# EAGLE design IN-16 Clock (EAGLE 8.1.0)
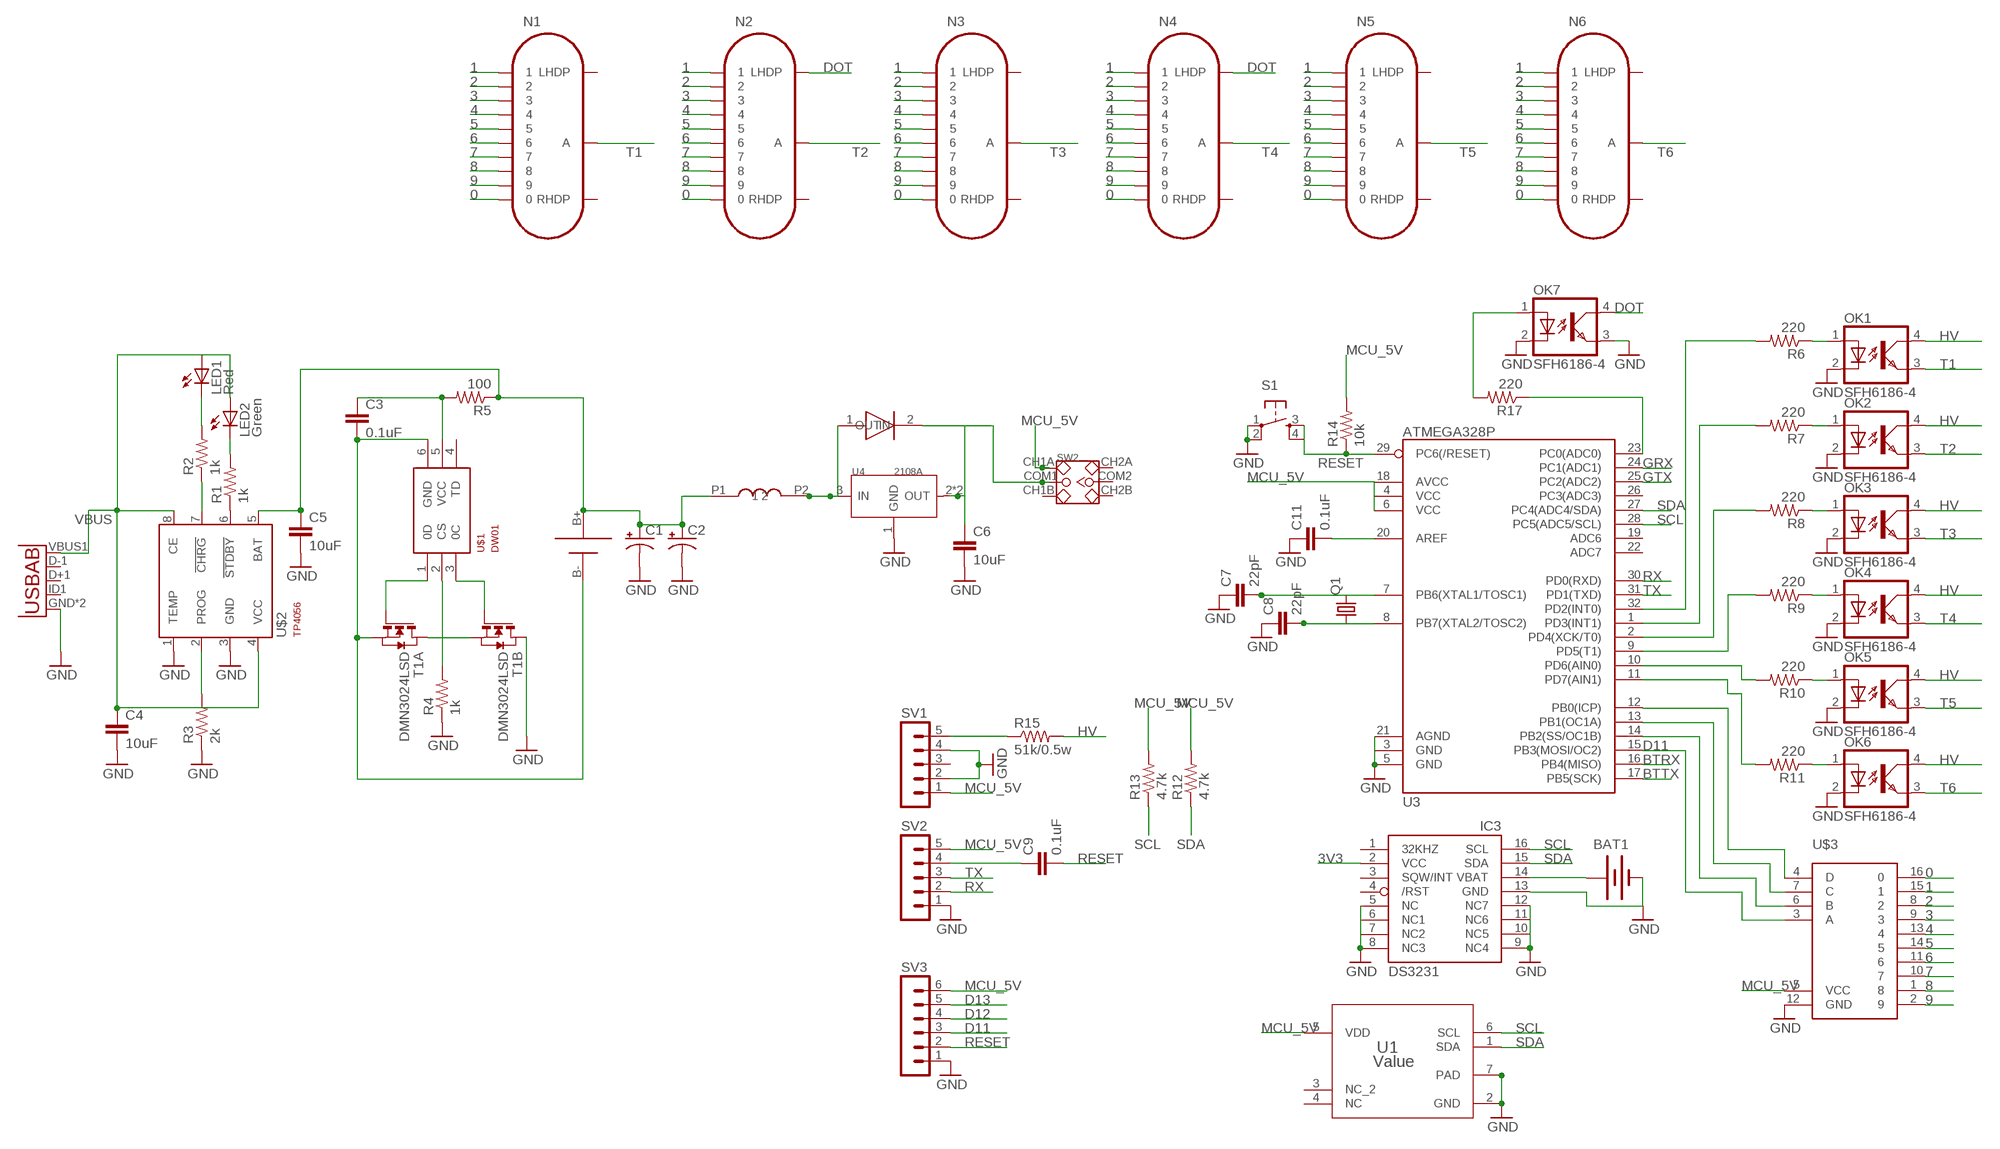
[diagram p0: schematic, sheet 1, part 1 of 2]
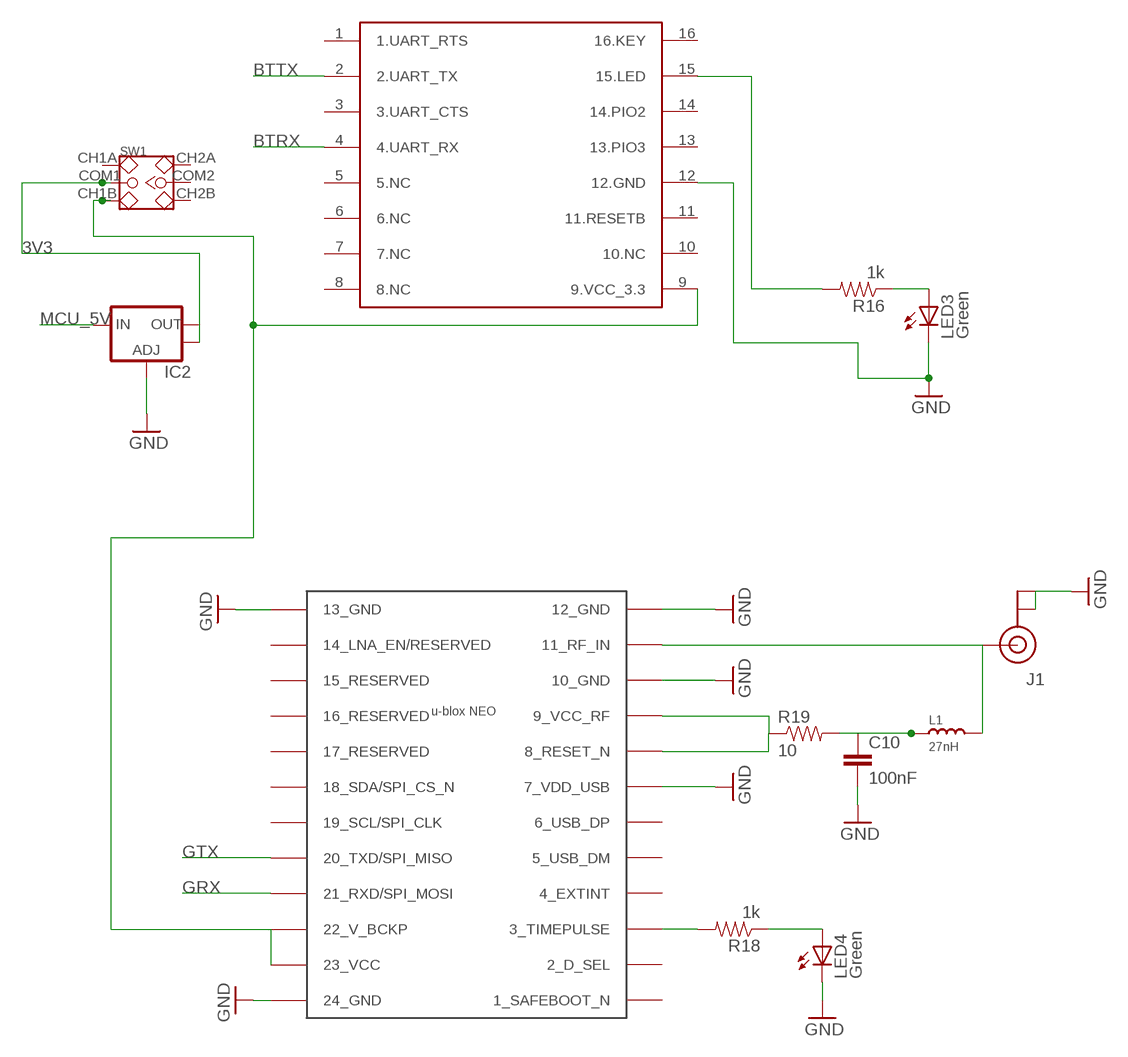
[diagram p1: schematic, sheet 1, part 2 of 2]

## Parts
BAT1  BATTERY20PTH  [BATTCOM_20MM_PTH]
C1  CAP_POLF80  [NIPPON_F80]
C2  CAP_POLF80  [NIPPON_F80]
C3  0.1uF  0.1UF-25V-5%(0603)  [0603-CAP]
C4  10uF  0.1UF-25V-5%(0603)  [0603-CAP]
C5  10uF  0.1UF-25V-5%(0603)  [0603-CAP]
C6  10uF  0.1UF-25V-5%(0603)  [0603-CAP]
C7  22pF  0.1UF-25V-5%(0603)  [0603-CAP]
C8  22pF  0.1UF-25V-5%(0603)  [0603-CAP]
C9  0.1uF  0.1UF-25V-5%(0603)  [0603-CAP]
C10  100nF  .22UF-CER  [0402-CAP]
C11  0.1uF  0.1UF-25V-5%(0603)  [0603-CAP]
IC2  V_REG_LM1117SOT223  [SOT223]
IC3  DS3231/SO  [SO16W]
J1  U.FL  [U.FL]
L1  27nH  SMD-FERRITE-BEAD-2500R-50MA(0603)  [L0603]
LED1  Red  LEDCHIP-LED0805  [CHIP-LED0805]
LED2  Green  LEDCHIP-LED0805  [CHIP-LED0805]
LED3  Green  LEDCHIP-LED0805  [CHIP-LED0805]
LED4  Green  LEDCHIP-LED0805  [CHIP-LED0805]
N1  IN-16  [IN-16]
N2  IN-16  [IN-16]
N3  IN-16  [IN-16]
N4  IN-16  [IN-16]
N5  IN-16  [IN-16]
N6  IN-16  [IN-16]
OK1  SFH6186-4  [SMD4-7]
OK2  SFH6186-4  [SMD4-7]
OK3  SFH6186-4  [SMD4-7]
OK4  SFH6186-4  [SMD4-7]
OK5  SFH6186-4  [SMD4-7]
OK6  SFH6186-4  [SMD4-7]
OK7  SFH6186-4  [SMD4-7]
Q1  CRYSTALSM49  [SM49]
R1  1k  1.2MOHMS-1/10W-1%(0603)  [0603-RES]
R2  1k  1.2MOHMS-1/10W-1%(0603)  [0603-RES]
R3  2k  1.2MOHMS-1/10W-1%(0603)  [0603-RES]
R4  1k  1.2MOHMS-1/10W-1%(0603)  [0603-RES]
R5  100  1.2MOHMS-1/10W-1%(0603)  [0603-RES]
R6  220  1.2MOHMS-1/10W-1%(0603)  [0603-RES]
R7  220  1.2MOHMS-1/10W-1%(0603)  [0603-RES]
R8  220  1.2MOHMS-1/10W-1%(0603)  [0603-RES]
R9  220  1.2MOHMS-1/10W-1%(0603)  [0603-RES]
R10  220  1.2MOHMS-1/10W-1%(0603)  [0603-RES]
R11  220  1.2MOHMS-1/10W-1%(0603)  [0603-RES]
R12  4.7k  1.2MOHMS-1/10W-1%(0603)  [0603-RES]
R13  4.7k  1.2MOHMS-1/10W-1%(0603)  [0603-RES]
R14  10k  1.2MOHMS-1/10W-1%(0603)  [0603-RES]
R15  51k/0.5w  R-US_0207/12  [0207/12]
R16  1k  1.2MOHMS-1/10W-1%(0603)  [0603-RES]
R17  220  1.2MOHMS-1/10W-1%(0603)  [0603-RES]
R18  1k  1.2MOHMS-1/10W-1%(0603)  [0603-RES]
R19  10  RESISTOR0603  [0603-RES]
S1  TAC_SWITCHSMD  [TACTILE_SWITCH_SMD]
SV1  MA05-1  [MA05-1]
SV2  MA05-1  [MA05-1]
SV3  MA06-1  [MA06-1]
SW1  SMD-TOGGLE-SWITCH-2CH(2X3P-7X3.5MM)  [SW6-2.54-SMD-7.0X3.5X1.5MM]
SW2  SMD-TOGGLE-SWITCH-2CH(2X3P-7X3.5MM)  [SW6-2.54-SMD-7.0X3.5X1.5MM]
T1  DMN3024LSD  [TSSOP-8]
U1  Value  HDC1080DMBR  [DMB0006A]
U2  USB""  [USB-MICRO-SMD]
U3  ATMEGA328P  ATMEGA328_SMT  [TQFP32-08]
U4  2108A  PMIC-CJA1117B-3.3(SOT-89)  [SOT-89]
U$1  DW01  [SOT23-6]
U$2  TP4056  [SOT23-8]
U$3  K155ID1  [DIL16-KIT]
U$5  22uH  CD54  [CD54]
U$6  SMA-SS34  [SMA-SS34]
U$7  18650SMD  [18650SMD]
U$8  NEO-M8  [NEO-M8]
U$9  HM-13  [HM-13]

## Nets
0: N1.0 N2.0 N3.0 N4.0 N5.0 N6.0 U$3.16
1: N1.1 N2.1 N3.1 N4.1 N5.1 N6.1 U$3.15
2: N1.2 N2.2 N3.2 N4.2 N5.2 N6.2 U$3.8
3: N1.3 N2.3 N3.3 N4.3 N5.3 N6.3 U$3.9
3V3: IC2.2(OUT) IC2.4(OUT) IC3.2(VCC) SW1.COM1
4: N1.4 N2.4 N3.4 N4.4 N5.4 N6.4 U$3.13
5: N1.5 N2.5 N3.5 N4.5 N5.5 N6.5 U$3.14
6: N1.6 N2.6 N3.6 N4.6 N5.6 N6.6 U$3.11
7: N1.7 N2.7 N3.7 N4.7 N5.7 N6.7 U$3.10
8: N1.8 N2.8 N3.8 N4.8 N5.8 N6.8 U$3.1
9: N1.9 N2.9 N3.9 N4.9 N5.9 N6.9 U$3.2
BTRX: U3.16(PB4(MISO)) U$9.4(4.UART_RX)
BTTX: U3.17(PB5(SCK)) U$9.2(2.UART_TX)
D11: SV3.3 U3.15(PB3(MOSI/OC2)) U$3.3(A)
D12: SV3.4
D13: SV3.5
DOT: N2.LHDP N4.LHDP OK7.4(COL)
GND: BAT1.2(-) C1.- C2.- C4.2 C5.2 C6.2 C7.1 C8.1 C10.2 C11.1 IC2.1(ADJ) IC3.5(NC) IC3.6(NC1) IC3.7(NC2) IC3.8(NC3) IC3.9(NC4) IC3.10(NC5) IC3.11(NC6) IC3.12(NC7) IC3.13(GND) J1.P$1(GND) J1.P$2(GND) LED3.C LED4.C OK1.2(C) OK2.2(C) OK3.2(C) OK4.2(C) OK5.2(C) OK6.2(C) OK7.2(C) OK7.3(EMIT) R3.1 R4.1 S1.1 S1.2 SV1.2 SV1.4 SV2.1 SV3.1 T1.8(B:D) U1.2(GND) U1.7(PAD) U2.GND U2.GND1(GND) U3.3(GND) U3.5(GND) U3.21(AGND) U4.1(GND) U$2.1(TEMP) U$2.3(GND) U$3.12(GND) U$8.7(7_VDD_USB) U$8.10(10_GND) U$8.12(12_GND) U$8.13(13_GND) U$8.24(24_GND) U$9.12(12.GND)
GRX: U3.24(PC1(ADC1)) U$8.21(21_RXD/SPI_MOSI)
GTX: U3.25(PC2(ADC2)) U$8.20(20_TXD/SPI_MISO)
HV: OK1.4(COL) OK2.4(COL) OK3.4(COL) OK4.4(COL) OK5.4(COL) OK6.4(COL) R15.2
MCU_5V: IC2.3(IN) R12.2 R13.2 R14.2 SV1.1 SV2.5 SV3.6 SW2.CH1A U1.5(VDD) U3.4(VCC) U3.6(VCC) U3.18(AVCC) U$3.5(VCC)
N$1: LED2.C R1.2
N$2: R1.1 U$2.6(!STDBY)
N$3: LED1.C R2.2
N$4: R2.1 U$2.7(!CHRG)
N$5: R3.2 U$2.2(PROG)
N$6: U4.3(IN) U$5.P2 U$6.1(IN)
N$7: C6.1 SW2.COM1 U4.2(OUT) U4.4(OUT) U$6.2(OUT)
N$8: T1.1(A:D) T1.6(B:S) T1.7(B:S)
N$9: T1.4(A:G) U$1.1(0D)
N$10: T1.5(B:G) U$1.3(0C)
N$11: R4.2 U$1.2(CS)
N$12: C3.2 T1.2(A:S) T1.3(A:S) U$1.6(GND) U$7.B-
N$13: C3.1 R5.2 U$1.5(VCC)
N$14: C1.+ C2.+ C5.1 R5.1 U$2.5(BAT) U$5.P1 U$7.B+
N$15: C7.2 Q1.2 U3.7(PB6(XTAL1/TOSC1))
N$16: C8.2 Q1.1 U3.8(PB7(XTAL2/TOSC2))
N$17: BAT1.1(+) IC3.14(VBAT)
N$18: C11.2 U3.20(AREF)
N$19: R15.1 SV1.5
N$20: R18.2 U$8.3(3_TIMEPULSE)
N$21: LED4.A R18.1
N$22: OK1.1(A) R6.1
N$23: OK2.1(A) R7.1
N$24: OK3.1(A) R8.1
N$25: OK4.1(A) R9.1
N$26: OK5.1(A) R10.1
N$27: OK6.1(A) R11.1
N$28: R6.2 U3.32(PD2(INT0))
N$29: R7.2 U3.1(PD3(INT1))
N$30: R8.2 U3.2(PD4(XCK/T0))
N$31: R9.2 U3.9(PD5(T1))
N$32: R10.2 U3.10(PD6(AIN0))
N$33: R11.2 U3.11(PD7(AIN1))
N$34: U3.12(PB0(ICP)) U$3.4(D)
N$35: U3.13(PB1(OC1A)) U$3.7(C)
N$36: U3.14(PB2(SS/OC1B)) U$3.6(B)
N$37: R17.1 U3.23(PC0(ADC0))
N$39: SW1.CH1B U$8.22(22_V_BCKP) U$8.23(23_VCC) U$9.9(9.VCC_3.3)
N$40: OK7.1(A) R17.2
N$41: C9.1 SV2.4
N$42: R16.2 U$9.15(15.LED)
N$43: LED3.A R16.1
N$44: C10.1 L1.1 R19.2
N$45: R19.1 U$8.8(8_RESET_N) U$8.9(9_VCC_RF)
N$47: J1.P$3(SIGNAL) L1.2 U$8.11(11_RF_IN)
RESET: C9.2 R14.1 S1.3 S1.4 SV3.2 U3.29(PC6(/RESET))
RX: SV2.2 U3.30(PD0(RXD))
SCL: IC3.16(SCL) R13.1 U1.6(SCL) U3.28(PC5(ADC5/SCL))
SDA: IC3.15(SDA) R12.1 U1.1(SDA) U3.27(PC4(ADC4/SDA))
T1: N1.A OK1.3(EMIT)
T2: N2.A OK2.3(EMIT)
T3: N3.A OK3.3(EMIT)
T4: N4.A OK4.3(EMIT)
T5: N5.A OK5.3(EMIT)
T6: N6.A OK6.3(EMIT)
TX: SV2.3 U3.31(PD1(TXD))
VBUS: C4.1 LED1.A LED2.A U2.VBUS1(VBUS) U$2.4(VCC) U$2.8(CE)
Unconnected: IC3.1(32KHZ) IC3.3(SQW/INT) IC3.4(/RST) N1.LHDP N1.RHDP N2.RHDP N3.LHDP N3.RHDP N4.RHDP N5.LHDP N5.RHDP N6.LHDP N6.RHDP SV1.3 SW1.CH1A SW1.CH2A SW1.CH2B SW1.COM2 SW2.CH1B SW2.CH2A SW2.CH2B SW2.COM2 U1.3(NC_2) U1.4(NC) U2.D+1(D+) U2.D-1(D-) U2.ID1(USBID) U3.19(ADC6) U3.22(ADC7) U3.26(PC3(ADC3)) U$1.4(TD) U$8.1(1_SAFEBOOT_N) U$8.2(2_D_SEL) U$8.4(4_EXTINT) U$8.5(5_USB_DM) U$8.6(6_USB_DP) U$8.14(14_LNA_EN/RESERVED) U$8.15(15_RESERVED) U$8.16(16_RESERVED) U$8.17(17_RESERVED) U$8.18(18_SDA/SPI_CS_N) U$8.19(19_SCL/SPI_CLK) U$9.1(1.UART_RTS) U$9.3(3.UART_CTS) U$9.5(5.NC) U$9.6(6.NC) U$9.7(7.NC) U$9.8(8.NC) U$9.10(10.NC) U$9.11(11.RESETB) U$9.13(13.PIO3) U$9.14(14.PIO2) U$9.16(16.KEY)

## Library data of the parts
BAT1 = SparkFun-Electromechanical:BATTERY: Battery Holders Various common sizes : AA, AAA, 20mm coin cell and 12mm coin cell. 20MM_4LEGS, BATT-10373
C1 C2 = SparkFun-Capacitors:CAP_POL: Capacitor Polarized These are standard SMD and PTH capacitors. Normally 10uF, 47uF, and 100uF in electrolytic and tantalum varieties. Always verify the external diameter of the through hole cap, it varies with capacity, voltage, and manufacturer. The EIA devices should be standard.
C3 C9 C11 = SparkFun-Capacitors:0.1UF-25V-5%(0603): CAP-08604; PROD_ID: CAP-08604
C4-C8 = SparkFun-Capacitors:0.1UF-25V-5%(0603): CAP-08604; PROD_ID: CAP-08604; VALUE: 0.1uF
C10 = SparkFun-Capacitors:.22UF-CER: .22uF ceramic SMT CAP-09885- 50V +80%/-20% (0603); PROD_ID: CAP-09885; VALUE: .22uF
IC2 = SparkFun-PowerIC:V_REG_LM1117: Voltage Regulator LM1117 Standard adjustable voltage regulator but in SMD form. Spark Fun Electronics SKU : COM-00595
IC3 = adafruit:DS3231
J1 = SparkFun-Connectors:U.FL: SMD antenna connector- WRL-09144; PROD_ID: CONN-09193
L1 = Seeed-OPL-Inductor:SMD-FERRITE-BEAD-2500R-50MA(0603): 303030020; VALUE: 2500R-50MA
LED1-LED4 = adafruit:LED: LED OSRAM: - CHIPLED LG R971, LG N971, LY N971, LG Q971, LY Q971, LO R971, LY R971 LH N974, LH R974 LS Q976, LO Q976, LY Q976 LO Q996 - Hyper CHIPLED LW Q18S LB Q993, LB Q99A, LB R99A - SideLED LS A670, LO A670, LY A670, LG A670, LP A670 LB A673, LV A673, LT A673, LW A673 LH A674 LY A675 LS A676, LA A676, LO A676, LY A676, LW A676 LS A679, LY A679, LG A679 - Hyper Micro SIDELED® LS Y876, LA Y876, LO Y876, LY Y876 LT Y87S - SmartLED LW L88C, LW L88S LB L89C, LB L89S, LG L890 LS L89K, LO L89K, LY L89K LS L896, LA L896, LO L896, LY L896 - TOPLED LS T670, LO T670, LY T670, LG T670, LP T670 LSG T670, LSP T670, LSY T670, LOP T670, LYG T670 LG T671, LOG T671, LSG T671 LB T673, LV T673, LT T673, LW T673 LH T674 LS T676, LA T676, LO T676, LY T676, LB T676, LH T676, LSB T676, LW T676 LB T67C, LV T67C, LT T67C, LS T67K, LO T67K, LY T67K, LW E67C LS E67B, LA E67B, LO E67B, LY E67B, LB E67C, LV E67C, LT E67C LW T67C LS T679, LY T679, LG T679 LS T770, LO T770, LY T770, LG T770, LP T770 LB T773, LV T773, LT T773, LW T773 LH T774 LS E675, LA E675, LY E675, LS T675 LS T776, LA T776, LO T776, LY T776, LB T776 LHGB T686 LT T68C, LB T68C - Hyper Mini TOPLED® LB M676 - Mini TOPLED Santana® LG M470 LS M47K, LO M47K, LY M47K Source: http://www.osram.convergy.de/
N1-N6 = russian-nixies:IN-16: IN-16: small numeric frontview nixie tube
OK1-OK7 = optocoupler:SFH618?*: Optocoupler, Phototransistor Output, Low Input Current Source: Data sheet <http://www.vishay.com/docs/83673/sfh618.pdf>; MF: VISHAY/TELEFUNKEN; MPN: SFH6186-4; OC_FARNELL: 1469530; OC_NEWARK: 21H7753
Q1 = adafruit:CRYSTAL: CRYSTAL; OC_FARNELL: unknown; OC_NEWARK: unknown
R1-R14 R16-R18 = SparkFun-Resistors:1.2MOHMS-1/10W-1%(0603): RES-10055; PROD_ID: RES-10055; VALUE: 1.2M
R15 = resistor:R-US_: RESISTOR, American symbol
R19 = SparkFun-Resistors:RESISTOR: Resistor Basic schematic elements and footprints for 0603, 1206, and PTH resistors.
S1 = SparkFun-Electromechanical:TAC_SWITCH: Momentary Switch Button commonly used for reset or general input. Spark Fun Electronics SKU : COM-00097 SMT- SWCH-08247; PROD_ID: SWCH-08247
SV1 SV2 = con-lstb:MA05-1: PIN HEADER; OC_FARNELL: unknown; OC_NEWARK: unknown
SV3 = con-lstb:MA06-1: PIN HEADER; OC_FARNELL: unknown; OC_NEWARK: unknown
SW1 SW2 = Seeed-OPL-Switch:SMD-TOGGLE-SWITCH-2CH(2X3P-7X3.5MM): 311030005
T1 = FS8205A:DMN3024LSD: DUAL N-CHANNEL ENHANCEMENT MODE MOSFET data sheet <http://goo.gl/dRgboR> Dave.Calaway Eagle Library <https://goo.gl/Muy1Tr>
U1 = HDC1080:HDC1080DMBR; ALTERNATEPARTNUMBER: HDC1080DMBT; APPLICATION_BUILDNUMBER: *; COMPTYPE: IC; MANUFACTURER: Texas Instruments; MOUNTTYPE: SMT; PACKAGEREFERENCE: DMB0006A; PARTNUMBER: HDC1080DMBR; PIN_COUNT: 7; REFDES: RefDes; TYPE: TYPE
U2 = MicroUSB Long:USB: This is a USB AB connector that is compatible with USB OTG. i.e. this connector can serve as a host or device
U3 = SparkFun-DigitalIC:ATMEGA328_SMT: 32-Pin Atmega328 part Commonly used on Arduino compatible boards Available in QFP and QFN packages TQFP is IC-09069 QFN is non-stock; PROD_ID: IC-09069
U4 = Seeed-OPL-ic:PMIC-CJA1117B-3.3(SOT-89): 310030095; MPN: CJA1117B-3.3; VALUE: CJA1117B-3.3-SOT89
U$1 = DW01:DW01: The DW01-P battery protection IC is designed to protect lithium-ion/polymer battery from damage or degrading the lifetime due to overcharge, overdischarge, and/or overcurrent for one-cell lithium-ion/polymer battery powered systems, such as cellular phones. Data sheet <http://goo.gl/4y108d> Dave.Calaway Eagle Library <https://goo.gl/Muy1Tr>
U$2 = TP4056:TP4056: TP4056 Data sheet <http://goo.gl/J7k8TF> Dave.Calaway Eagle Library <https://goo.gl/Muy1Tr>
U$3 = Nixie:K155ID1
U$5 = CD54:CD54
U$6 = SMA-SS34:SMA-SS34
U$7 = 18650SMD:18650SMD
U$8 = ubloxLib:NEO-M8: u-blox NEO GNSS module
U$9 = HM-13:HM-13

## Board
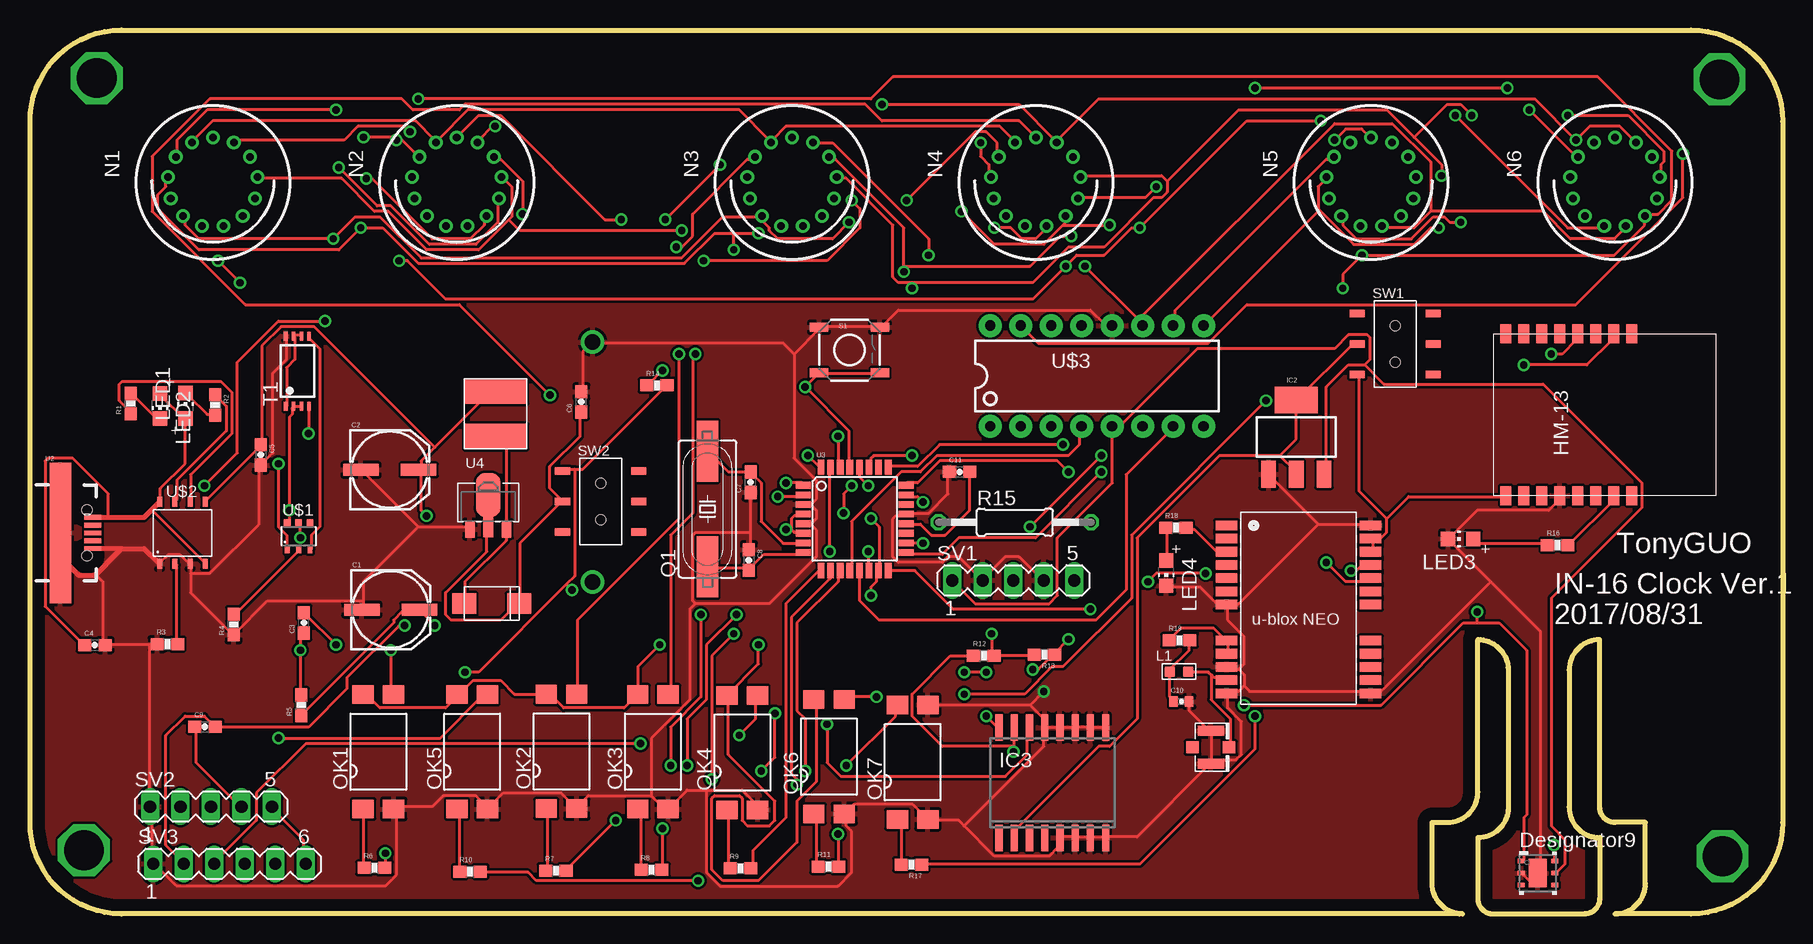
[diagram p2: board, top side]
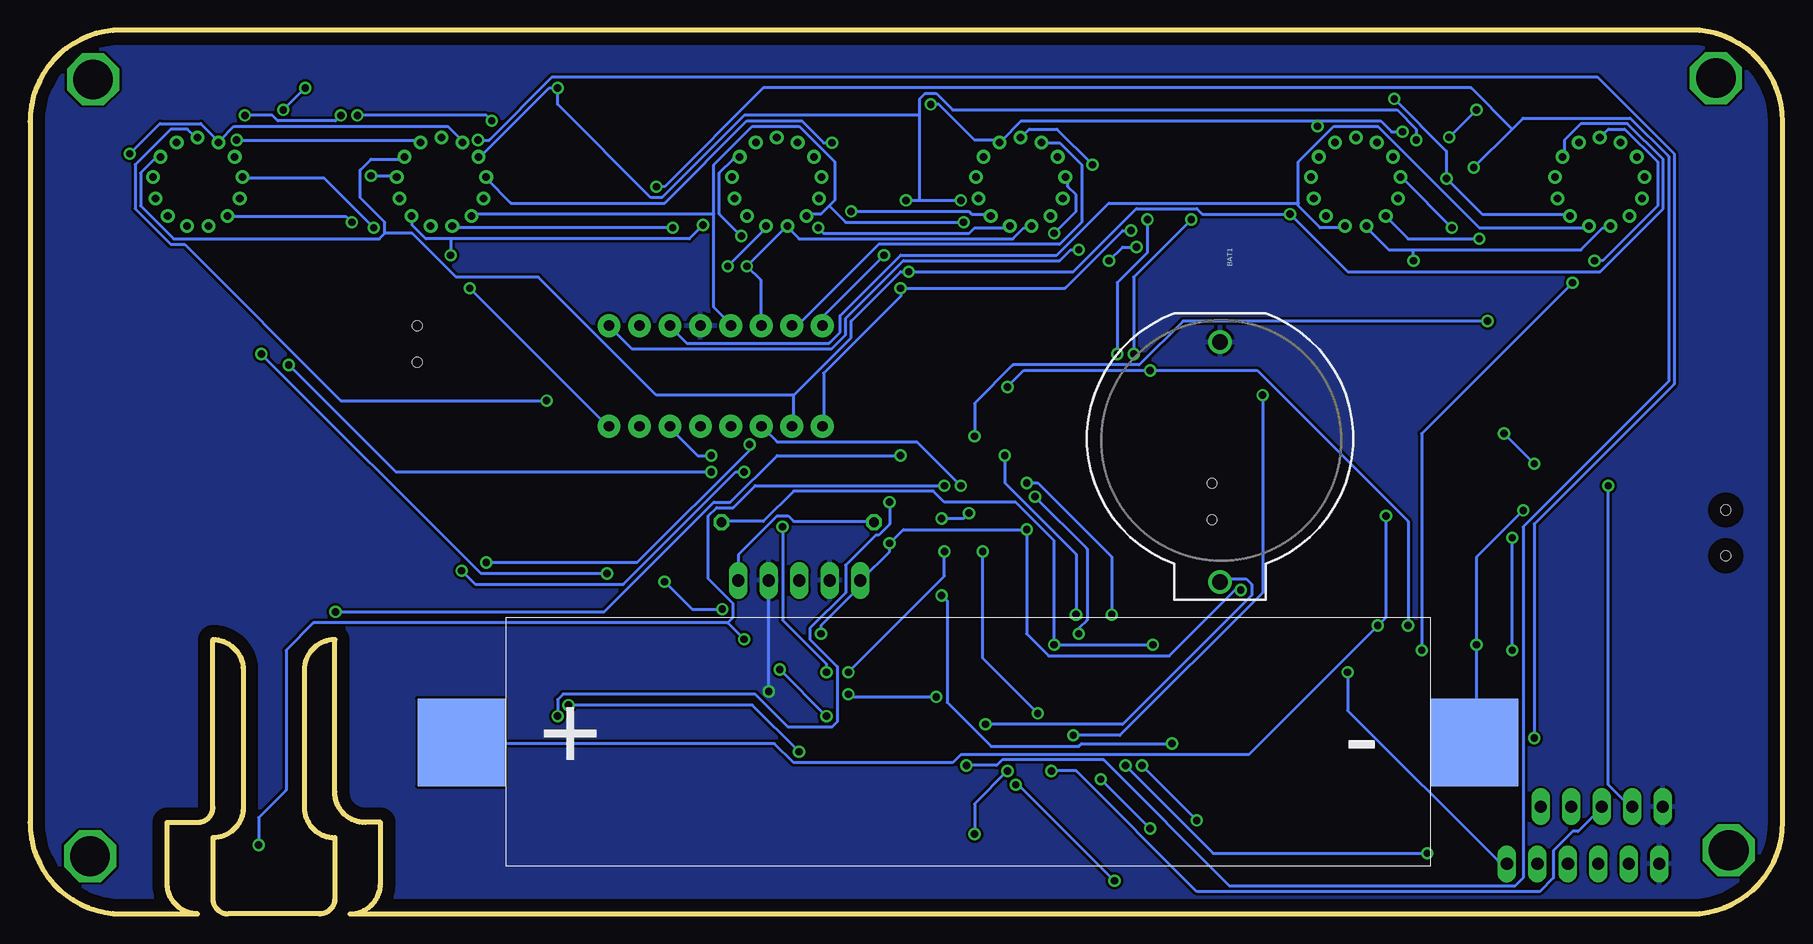
[diagram p3: board, bottom side, seen from below]

Size 146.05 x 73.66 mm. Coordinates in mm from the lower left corner, seen from the top.
Outline: 123.19,8.89 arc-90 120.65,6.35 120.65,1.27 arc90 121.92,0 129.54,0 arc90 130.81,1.27 130.81,6.35 arc-90 128.27,8.89 128.27,20.32 arc-90 130.81,22.86 130.81,8.89 arc90 132.08,7.62 134.62,7.62 134.62,2.54 arc-90 132.08,0 138.43,0 arc90 146.05,7.62 146.05,66.04 arc90 138.43,73.66 7.62,73.66 arc90 0,66.04 0,7.62 arc90 7.62,0 119.38,0 arc-90 116.84,2.54 116.84,7.62 118.11,7.62 arc90 120.65,10.16 120.65,22.86 arc-90 123.19,20.32 123.19,8.89
Copper layers (1*16): Top 0.035mm / dielectric 1.5mm / Bottom 0.035mm
Design rules "default": minimum track width 10mil, minimum drill 24mil, track to track 8mil, track to pad 8mil, pad to pad 8mil, via to via 8mil, smd to smd 8mil, copper to edge 40mil, drill to drill 8mil, minimum pad ring 10mil, minimum via ring 8mil, stop-mask expansion 4mil, vias tented up to drill 0mil, thermal gap 10mil

### Footprints (pad centres in the part's own frame; a part is rotated, then mirrored left to right if it is on the bottom)
BATTCOM_20MM_PTH = drill 1.3: 1 11.85,0; 2 -8.15,0
NIPPON_F80 = smd 2.95 x 1: + 2.4,0; - -2.4,0
0603-CAP = smd 1.1 x 1: 1 -0.85,0; 2 0.85,0
0402-CAP = smd 0.7 x 0.9: 1 -0.65,0; 2 0.65,0
SOT223 = smd 1.219 x 2.235: 1 -2.311,-3.099; 2 0,-3.099; 3 2.311,-3.099 | smd 3.6 x 2.2: 4 0,3.099
SO16W = smd 0.6 x 2.2: 1 -4.445,-4.6; 2 -3.175,-4.6; 3 -1.905,-4.6; 4 -0.635,-4.6; 5 0.635,-4.6; 6 1.905,-4.6; 7 3.175,-4.6; 8 4.445,-4.6; 9 4.445,4.6; 10 3.175,4.6; 11 1.905,4.6; 12 0.635,4.6; 13 -0.635,4.6; 14 -1.905,4.6; 15 -3.175,4.6; 16 -4.445,4.6
U.FL = smd 2.2 x 0.85: P$1 0,1.375; P$2 0,-1.375 | smd 1.05 x 1: P$3 1.525,0; P$4 -1.525,0
L0603 = smd 0.889 x 0.889: 1 -0.762,0; 2 0.762,0
CHIP-LED0805 = smd 1.2 x 1.2: A 0,-1.05; C 0,1.05
IN-16 = drill 0.63: 0 -1.745,-3.325; 1 1.745,-3.325; 2 -2.49,2.81; 3 3.727,-0.453; 4 2.49,2.81; 5 0.898,3.645; 6 -0.898,3.645; 7 3.09,-2.133; 8 -3.727,-0.453; 9 -3.09,-2.133; A 0,-3.755; LHDP -3.511,1.331; RHDP 3.511,1.331
SMD4-7 = smd 1.78 x 1.55: 1 -1.27,-4.77; 2 1.27,-4.77; 3 1.27,4.77; 4 -1.27,4.77
SM49 = smd 5.08 x 1.778: 1 -4.826,0; 2 4.826,0
0603-RES = smd 1.1 x 1: 1 -0.85,0; 2 0.85,0
0207/12 = drill 0.813 octagon: 1 -6.35,0; 2 6.35,0
TACTILE_SWITCH_SMD = smd 1.524 x 0.762: 1 -2.54,1.905; 2 2.54,1.905; 3 -2.54,-1.905; 4 2.54,-1.905
MA05-1 = drill 1.016 long: 1 -5.08,0; 2 -2.54,0; 3 0,0; 4 2.54,0; 5 5.08,0
MA06-1 = drill 1.016 long: 1 -6.35,0; 2 -3.81,0; 3 -1.27,0; 4 1.27,0; 5 3.81,0; 6 6.35,0
SW6-2.54-SMD-7.0X3.5X1.5MM = smd 1.27 x 0.635: CH1A -3.175,2.54; CH1B -3.175,-2.54; CH2A 3.175,2.54; CH2B 3.175,-2.54; COM1 -3.175,0; COM2 3.175,0 | hole 0.813: 0,1.524; 0,-1.524
TSSOP-8 = smd 0.3 x 0.75: 1 -0.975,-2.925; 2 -0.325,-2.925; 3 0.325,-2.925; 4 0.975,-2.925; 5 0.975,2.925; 6 0.325,2.925; 7 -0.325,2.925; 8 -0.975,2.925
DMB0006A = smd 0.6 x 0.4: 1 -1.4,1; 2 -1.4,0; 3 -1.4,-1; 4 1.4,-1; 5 1.4,0; 6 1.4,1 | smd 1.5 x 2.4: 7 0,0 | smd 0.5 x 0.5: V -0.5,0
USB-MICRO-SMD = smd 1.4 x 0.4: D+1 2.7,0; D-1 2.7,0.65; GND1 2.7,-1.3; ID1 2.7,-0.65; VBUS1 2.7,1.3 | smd 1.778 x 11.684: GND 0,0 | hole 0.85: 2.2,1.9; 2.2,-1.9
TQFP32-08 = smd 1.27 x 0.559: 1 -4.293,2.8; 2 -4.293,2; 3 -4.293,1.2; 4 -4.293,0.4; 5 -4.293,-0.4; 6 -4.293,-1.2; 7 -4.293,-2; 8 -4.293,-2.8; 17 4.293,-2.8; 18 4.293,-2; 19 4.293,-1.2; 20 4.293,-0.4; 21 4.293,0.4; 22 4.293,1.2; 23 4.293,2; 24 4.293,2.8 | smd 0.559 x 1.27: 9 -2.8,-4.293; 10 -2,-4.293; 11 -1.2,-4.293; 12 -0.4,-4.293; 13 0.4,-4.293; 14 1.2,-4.293; 15 2,-4.293; 16 2.8,-4.293; 25 2.8,4.293; 26 2,4.293; 27 1.2,4.293; 28 0.4,4.293; 29 -0.4,4.293; 30 -1.2,4.293; 31 -2,4.293; 32 -2.8,4.293
SOT-89 = smd 0.8 x 1.4: 1 -1.524,-1.905; 3 1.524,-1.905 | smd 0.8 x 1.9: 2 0,-1.651 | smd 2.032 x 3.65: 4 0,0.94
SOT23-6 = smd 0.4 x 0.55: 1 -0.95,-1.15; 2 0,-1.15; 3 0.95,-1.15 | smd 0.55 x 0.55: 4 0.95,1.15; 5 0,1.15; 6 -0.95,1.15
SOT23-8 = smd 0.42 x 0.835: 1 -1.905,-2.58; 2 -0.635,-2.58; 3 0.635,-2.58; 4 1.905,-2.58; 5 1.905,2.58; 6 0.635,2.58; 7 -0.635,2.58; 8 -1.905,2.58
DIL16-KIT = drill 0.864 pad 1.905: 1 -8.89,-4.191; 2 -6.35,-4.191; 3 -3.81,-4.191; 4 -1.27,-4.191; 5 1.27,-4.191; 6 3.81,-4.191; 7 6.35,-4.191; 8 8.89,-4.191; 9 8.89,4.191; 10 6.35,4.191; 11 3.81,4.191; 12 1.27,4.191; 13 -1.27,4.191; 14 -3.81,4.191; 15 -6.35,4.191; 16 -8.89,4.191
CD54 = smd 5.2 x 2.1: P1 2.6,-1; P2 2.6,-4.8
SMA-SS34 = smd 2 x 1.7: 1 0,-1.4; 2 4.6,-1.4
18650SMD = smd 7.3 x 7.3: B+ -3.7,10.3; B- 80.7,10.3
NEO-M8 = smd 1.8 x 0.8: 1 6.4,-7.4; 2 6.4,-6.3; 3 6.4,-5.2; 4 6.4,-4.1; 5 6.4,-3; 6 6.4,-1.9; 7 6.4,-0.8; 8 6.4,2.2; 9 6.4,3.3; 10 6.4,4.4; 11 6.4,5.5; 12 6.4,6.6; 13 -5.6,6.6; 14 -5.6,5.5; 15 -5.6,4.4; 16 -5.6,3.3; 17 -5.6,2.2; 18 -5.6,-0.8; 19 -5.6,-1.9; 20 -5.6,-3; 21 -5.6,-4.1; 22 -5.6,-5.2; 23 -5.6,-6.3; 24 -5.6,-7.4
HM-13 = smd 1.6 x 0.9: 1 0,11.5; 2 0,10; 3 0,8.5; 4 0,7; 5 0,5.5; 6 0,4; 7 0,2.5; 8 0,1; 9 13.5,1; 10 13.5,2.5; 11 13.5,4; 12 13.5,5.5; 13 13.5,7; 14 13.5,8.5; 15 13.5,10; 16 13.5,11.5

### Placement (x,y rotation side)
BAT1  46.88,39.51 270 bottom
C1  30.05,25.35 0 top
C2  29.98,37.01 0 top
C3  22.83,24.26 90 top
C4  5.41,22.4 0 top
C5  19.22,38.26 270 top
C6  45.94,42.67 90 top
C7  60.05,35.97 90 top
C8  59.9,29.49 270 top
C9  14.58,15.6 0 top
C10  95.94,17.7 0 top
C11  77.47,36.83 0 top
IC2  105.52,39.74 0 top
IC3  85.19,10.93 0 top
J1  98.4,13.88 0 top
L1  95.74,20.2 0 top
LED1  12.95,42.35 0 top
LED2  10.83,42.32 180 top
LED3  119.22,31.25 90 top
LED4  94.69,28.4 180 top
N1  15.24,60.96 180 top
N2  35.56,60.96 180 top
N3  63.5,60.96 180 top
N4  83.82,60.96 180 top
N5  111.76,60.96 180 top
N6  132.08,60.96 180 top
OK1  29.03,13.51 0 top
OK2  44.29,13.54 0 top
OK3  51.91,13.51 0 top
OK4  59.36,13.44 0 top
OK5  36.85,13.51 0 top
OK6  66.58,13.11 0 top
OK7  73.55,12.65 0 top
Q1  56.46,33.74 90 top
R1  8.39,42.52 90 top
R2  15.42,42.41 270 top
R3  11.45,22.49 0 top
R4  16.97,24.12 90 top
R5  22.61,17.39 90 top
R6  28.71,3.84 0 top
R7  43.82,3.6 0 top
R8  51.79,3.67 0 top
R9  59.21,3.8 0 top
R10  36.68,3.52 0 top
R11  66.53,3.95 0 top
R12  79.48,21.52 0 top
R13  84.53,21.61 180 top
R14  52.24,44.04 0 top
R15  82.07,32.64 0 top
R16  127.3,30.74 0 top
R17  73.45,4.11 180 top
R18  95.49,32.2 0 top
R19  95.79,22.8 0 top
S1  68.29,46.99 0 top
SV1  81.94,27.79 0 top
SV2  15.08,8.94 0 top
SV3  16.62,4.17 0 top
SW1  113.77,47.49 0 top
SW2  47.55,34.37 0 top
T1  22.29,45.23 0 top
U1  125.66,3.41 0 top
U2  2.54,31.75 0 top
U3  68.72,32.92 0 top
U4  38.19,33.97 0 top
U$1  22.39,31.48 0 top
U$2  12.7,31.75 0 top
U$3  88.91,44.83 0 top
U$5  36.2,44.58 0 top
U$6  36.17,27.26 0 top
U$7  106.4,4 0 bottom
U$8  106.11,24.98 180 top
U$9  121.98,48.36 270 top

### Tracks (layer width: path | path; a pad name or v marks a point on that pad's centre or on a via)
0  (via drill 0.61)
  Top 0.254: N6.0 133.63,64.49 132.49,65.63 129.97,65.63 v128.83,64.49 125.4,67.92 89.05,67.92 85.62,64.49 N4.0 85.39,64.49 82.42,67.46 v70.99,67.46 | v31.67,65.18 31.22,65.63 27.33,65.63 26.19,64.49 17.04,64.49 N1.0 | v38.76,65.63 38.53,65.63 37.39,64.49 N2.0 | v74.88,54.89 74.88,56.26 66.88,64.26 65.28,64.26 N3.0
  Bottom 0.254: v128.83,64.49 113.51,64.49 N5.0 | v31.67,65.18 32.59,65.18 33.5,66.09 38.76,66.09 | 38.76,66.09 63.45,66.09 65.05,64.49 N3.0 65.28,64.49 67.33,64.49 70.31,67.46 v70.99,67.46 | 38.76,66.09 v38.76,65.63 | v74.88,54.89 79.91,49.86 79.91,49.17 U$3.16
1  (via drill 0.61)
  Top 0.254: N1.1 13.61,64.49 15.21,66.09 32.13,66.09 33.73,64.49 N2.1 33.96,64.49 36.47,67.01 59.11,67.01 61.62,64.49 N3.1 61.85,64.49 62.99,65.63 80.82,65.63 81.97,64.49 N4.1 | v137.74,63.35 137.74,59.69 128.83,50.77 101.4,50.77 98.2,47.57 84.02,47.57 82.65,48.95 U$3.15
  Bottom 0.254: N5.1 110.08,64.49 111.23,65.63 129.06,65.63 130.2,64.49 N6.1 130.43,64.49 131.8,65.86 135.23,65.86 v137.74,63.35 | U$3.15 82.42,49.17 81.97,49.17 75.34,55.8 60.25,55.8 58.42,57.63 58.42,62.43 60.25,64.26 61.62,64.26 N3.1
2  (via drill 0.61)
  Top 0.254: v28.02,61.29 28.47,61.29 33.5,56.26 36.7,56.26 37.85,57.4 37.85,58.09 N2.2 | v77.62,58.55 80.37,55.8 84.48,55.8 86.08,57.4 | 86.08,57.4 86.31,57.63 86.31,58.09 N4.2 | 86.08,57.4 v89.97,57.4 | v109.4,52.15 109.4,53.29 v111,54.89 132.03,54.89 134.54,57.4 134.54,58.09 N6.2 134.77,58.32 135.69,58.32 136.83,59.46 136.83,63.58 130.66,69.75 71.91,69.75 70.08,67.92 v32.36,67.92
  Bottom 0.254: N1.2 17.96,58.32 25.04,58.32 v28.02,61.29 28.02,63.58 v32.36,67.92 | v77.62,58.55 67.79,58.55 67.56,58.32 66.19,58.32 N3.2 | 111,56.26 91.11,56.26 v89.97,57.4 | 111,56.26 113.06,56.26 114.2,57.4 114.2,58.09 N5.2 | 111,56.26 v111,54.89 | v109.4,52.15 97.97,40.72 U$3.8
3  (via drill 0.61)
  Top 0.254: N1.3 11.33,61.29 11.33,60.6 10.64,59.92 10.64,58.78 14.07,55.35 25.73,55.35 v27.56,57.17 29.39,57.17 32.36,54.2 54.53,54.2 57.05,56.72 58.65,56.72 | 58.65,56.72 v60.71,56.72 | v79.22,64.26 79.22,63.12 79.91,62.43 79.91,61.52 N4.3 | v117.4,57.17 116.71,57.17 115.34,55.8 110.31,55.8 107.34,58.78 | 107.34,58.78 107.34,60.6 108.03,61.29 N5.3 | 107.34,58.78 107.34,58.55 97.97,49.17 U$3.9 | v58.65,55.35 58.65,56.72
  Bottom 0.254: v27.56,57.17 31.67,61.29 N2.3 | v60.71,56.72 58.88,58.55 58.88,59.92 59.56,60.6 59.56,61.29 N3.3 | v79.22,64.26 79.91,64.26 81.74,66.09 86.31,66.09 93.17,59.23 105.97,59.23 108.03,61.29 N5.3 | v117.4,57.17 121.51,61.29 128.14,61.29 N6.3 | v58.65,55.35 59.33,55.35 60.25,54.43 73.28,54.43 78.08,49.63 78.08,48.26 79.22,47.12 95.91,47.12 97.74,48.95 U$3.9
3V3
  Top 0.254: SW1.COM1 110.54,47.35 110.08,47.35 105.74,43 IC2.4 105.51,42.77 105.51,39.57 104.14,38.2 | 104.14,38.2 99.11,38.2 92.25,31.34 92.25,16.26 89.97,13.97 89.05,13.97 82.19,7.11 82.19,6.43 IC3.2 | 104.14,38.2 105.51,36.83 IC2.2
4  (via drill 0.61)
  Top 0.254: N1.4 12.93,58.09 12.93,57.4 14.07,56.26 v25.27,56.26 27.1,58.09 29.16,58.09 32.59,54.66 54.3,54.66 57.73,58.09 60.94,58.09 N3.4 61.16,58.09 61.16,57.63 61.62,57.17 61.62,56.95 62.31,56.26 66.88,56.26 v68.25,57.63 | v119.23,57.63 118.31,57.63 117.86,58.09 116.94,58.09 115.11,56.26 110.54,56.26 109.4,57.4 109.4,58.09 N5.4
  Bottom 0.254: v25.27,56.26 31.22,56.26 33.05,58.09 N2.4 | 79.45,59 78.99,59.46 78.99,62.66 81.97,65.63 85.85,65.63 89.05,62.43 89.05,58.32 | 79.45,59 80.14,58.32 81.28,58.32 N4.4 | 89.05,58.32 89.05,50.55 87.68,49.17 U$3.13 | 89.05,58.32 109.17,58.32 N5.4 | v119.23,57.63 119.69,58.09 129.51,58.09 N6.4 | v68.25,57.63 78.08,57.63 79.45,59
5  (via drill 0.61)
  Top 0.254: v118.77,66.55 128.14,57.17 131.12,57.17 N6.5 | v107.57,66.09 101.4,66.09 v92.48,57.17 91.8,57.17 89.51,54.89 87.22,54.89 v86.31,53.98 83.57,51.23 34.65,51.23 31.45,54.43 v30.76,54.43
  Bottom 0.254: 30.76,55.35 32.82,55.35 34.65,57.17 N2.5 | 30.76,55.35 16.81,55.35 14.99,57.17 14.53,57.17 N1.5 | N3.5 62.76,57.17 63.22,57.17 64.14,56.26 81.97,56.26 82.88,57.17 N4.5 83.11,57.17 v86.31,53.98 85.17,52.83 85.17,49.17 U$3.14 | v92.48,57.17 110.77,57.17 N5.5 | v118.77,66.55 108.03,66.55 v107.57,66.09 | v30.76,54.43 30.76,55.35
6  (via drill 0.61)
  Top 0.254: 116.71,58.55 115.34,57.17 112.83,57.17 N5.6 | 116.71,58.55 126.09,58.55 128.37,56.26 132.03,56.26 132.94,57.17 N6.6 | v80.37,57.17 81.74,57.17 82.65,56.26 83.8,56.26 84.71,57.17 N4.6 | v87.91,53.98 92.25,49.63 | 92.25,49.63 92.71,49.17 U$3.11 92.25,49.63 | 116.71,58.55 116.71,62.66 113.51,65.86 108.71,65.86 92.48,49.63 92.25,49.63
  Bottom 0.254: 40.36,59.23 40.36,59 38.53,57.17 36.47,57.17 N2.6 | 40.36,59.23 40.36,62.66 37.39,65.63 33.73,65.63 25.27,57.17 16.36,57.17 N1.6 | v80.37,57.17 79.91,56.72 67.79,56.72 67.33,57.17 64.59,57.17 N3.6 | v87.91,53.98 84.71,57.17 N4.6 | 40.36,59.23 56.13,59.23 60.48,54.89 73.51,54.89 78.54,49.86 78.54,48.49 79.45,47.57 91.34,47.57 92.71,48.95 U$3.11
7  (via drill 0.61)
  Top 0.254: N5.7 108.48,62.89 108.03,62.89 95.45,50.32 95.45,49.17 U$3.10 | v124.94,67.01 128.83,63.12 N6.7 | v102.08,68.83 v123.11,68.83 | v25.5,67.01 14.76,67.01 12.24,64.49 12.24,63.12 N1.7 | 30.53,64.72 30.76,64.72 32.36,63.12 N2.7 | 30.53,64.72 v27.79,64.72 | v53.85,55.57 54.3,55.57 55.22,56.49 55.22,58.32 59.79,62.89 60.25,62.89 N3.7 | v56.13,54.43 66.42,54.43 69.16,57.17 69.16,58.78 v68.48,59.46 | v73.05,59.46 78.77,65.18 79.68,65.18 80.59,64.26 80.59,63.12 N4.7 | v30.53,64.49 30.53,64.72
  Bottom 0.254: v123.11,68.83 v124.94,67.01 | N5.7 108.48,63.12 102.77,68.83 v102.08,68.83 102.08,67.46 94.31,59.69 93.4,59.69 86.54,66.55 71.91,66.55 | v27.79,64.72 v25.5,67.01 | v53.85,55.57 54.99,55.57 v56.13,54.43 | v73.05,59.46 71.91,59.46 | 71.91,59.46 v68.48,59.46 | v30.53,64.49 30.53,65.41 32.13,67.01 69.16,67.01 70.54,68.38 71.45,68.38 71.91,67.92 71.91,66.55 | 71.91,59.46 71.91,66.55
8  (via drill 0.61)
  Top 0.254: 39.9,57.86 40.13,58.09 40.13,60.6 39.45,61.29 N2.8 | 39.9,57.86 37.39,55.35 33.05,55.35 29.84,58.55 28.7,58.55 25.96,61.29 19.1,61.29 N1.8 | 73.51,52.6 83.57,52.6 86.54,55.57 89.51,55.57 93.62,59.69 94.31,59.69 94.77,60.15 94.77,61.06 | 73.51,52.6 72.36,52.6 71.91,53.06 71.91,57.4 68.02,61.29 67.33,61.29 N3.8 | 94.77,61.06 94.31,61.52 87.68,61.52 N4.8 | v117.63,61.52 117.63,62.43 115.34,64.72 | 115.34,64.72 113.06,67.01 100.71,67.01 94.77,61.06 | v128.14,66.55 133.17,66.55 136.14,63.58 136.14,62.66 135.91,62.43 135.91,61.52 N6.8 | v120.14,66.55 119.23,67.46 118.09,67.46 115.34,64.72 | 73.51,52.6 v73.51,52.15 | 39.9,57.86 40.82,56.95 v54.3,56.95
  Bottom 0.254: v117.63,61.52 115.57,61.52 N5.8 | v128.14,66.55 125.86,66.55 125.4,66.09 120.6,66.09 v120.14,66.55 | U$3.1 79.91,40.72 79.91,45.06 73.51,51.46 v73.51,52.15 59.79,52.15 54.99,56.95 v54.3,56.95
9  (via drill 0.61)
  Top 0.254: v41.05,58.32 41.05,61.06 39.22,62.89 38.76,62.89 N2.9 | 72.82,53.98 72.82,57.17 67.11,62.89 66.65,62.89 N3.9 | v86.77,56.49 85.85,56.49 83.34,53.98 72.82,53.98 | 72.82,53.98 v72.82,53.52
  Bottom 0.254: N1.9 18.19,63.12 18.19,64.49 16.81,65.86 12.93,65.86 9.96,62.89 9.96,58.78 15.21,53.52 36.25,53.52 v41.05,58.32 48.36,58.32 48.82,58.78 53.85,58.78 59.11,53.52 v72.82,53.52 73.51,53.52 77.62,49.4 77.62,48.03 82.42,43.23 | 116.48,56.72 116.48,57.63 118.54,59.69 118.54,61.98 117.63,62.89 114.88,62.89 N5.9 | 116.48,56.72 116.94,56.26 134.09,56.26 136.83,59 136.83,61.75 135.69,62.89 135.23,62.89 N6.9 | 82.42,43.23 82.42,40.72 U$3.2 | v86.77,56.49 88.59,58.32 88.59,61.75 87.45,62.89 87,62.89 N4.9 | 116.48,56.72 114.2,56.72 110.54,53.06 103.68,53.06 93.85,43.23 82.42,43.23
BTRX  (via drill 0.61)
  Top 0.254: v88.37,25.4 76.94,25.4 73.74,28.6 71.68,28.6 U3.16 | v93.17,27.69 93.85,28.37 v97.97,28.37 | v126.77,46.66 127.69,46.66 128.83,47.8 128.83,48.26 U$9.4
  Bottom 0.254: v88.37,25.4 90.88,25.4 v93.17,27.69 | v97.97,28.37 108.48,28.37 v126.77,46.66
BTTX  (via drill 0.61)
  Top 0.254: v89.28,36.83 83.8,31.34 77.39,31.34 76.02,29.97 73.05,29.97 U3.17 | v124.48,45.74 129.74,45.74 131.8,47.8 131.8,48.26 U$9.2
  Bottom 0.254: v89.28,36.83 115.57,36.83 v124.48,45.74
D11  (via drill 0.61)
  Top 0.254: v70.08,32.94 70.76,32.26 70.76,28.83 U3.15 70.54,28.6 70.54,27.69 70.08,27.23 v70.08,26.54 | v67.79,33.4 67.79,35 v68.48,35.69 | v50.88,14.2 22.99,14.2 18.87,10.08 18.87,7.8 15.44,4.37 SV3.3
  Bottom 0.254: v70.08,32.94 68.25,32.94 v67.79,33.4 | v68.48,35.69 72.14,39.34 83.8,39.34 84.94,40.49 U$3.3 | v50.88,14.2 58.42,14.2 58.65,13.97 65.96,13.97 69.62,17.63 69.62,26.09 v70.08,26.54
DOT  (via drill 0.61)
  Top 0.254: v68.02,12.37 72.14,16.48 72.14,17.4 OK7.4 | v25.73,62.2 28.93,59 30.07,59 33.27,55.8 37.16,55.8 38.99,57.63 38.99,59.46 N2.LHDP | v93.85,60.6 92.94,59.69 87.45,59.69 N4.LHDP
  Bottom 0.254: v68.02,12.37 65.51,12.37 65.05,12.83 56.59,12.83 46.08,2.31 22.3,2.31 21.61,3 21.61,32.26 9.5,44.37 9.5,63.12 12.7,66.32 21.61,66.32 22.53,65.41 | v25.73,62.2 22.53,65.41 | v93.85,60.6 93.17,60.6 84.94,68.83 25.96,68.83 22.53,65.41
GND  (via drill 0.61)
  Top 0.254: U1.2 124.48,3.23 124.94,2.77 125.4,2.77 125.86,3.23 U1.7 125.86,3.45 125.86,23.57 121.74,27.69 | U$9.12 127.69,34.77 126.54,33.63 120.6,33.63 118.31,31.34 LED3.C 118.31,31.11 121.74,27.69 | 107.34,32.49 111.68,32.49 U$8.24 | 107.34,32.49 103.23,36.6 IC2.1 | LED4.C 94.77,27.23 97.51,27.23 98.88,25.86 99.57,25.86 U$8.7 | 101.17,19 100.71,18.54 99.8,18.54 U$8.12 99.8,18.31 99.8,17.17 100.94,16.03 100.94,13.28 100.48,12.83 98.42,12.83 | 101.17,19 101.17,19.91 100.71,20.37 | 100.71,20.37 99.8,20.37 U$8.10 | 101.17,19 101.62,18.54 111.68,18.54 U$8.13 111.91,18.54 112.6,18.54 121.74,27.69 | 100.71,20.37 101.17,20.83 101.17,23.11 99.8,24.49 99.8,25.63 U$8.7 | 107.34,32.49 100.71,25.86 99.8,25.86 U$8.7 | C11.1 76.48,36.83 76.48,35 74.88,33.4 73.05,33.4 U3.21 72.82,33.17 72.14,33.17 71.91,32.94 71.91,29.74 72.36,29.29 76.02,29.29 76.48,29.74 77.39,29.74 79.22,27.91 SV1.2 79.45,27.91 81.28,29.74 82.42,29.74 84.25,27.91 SV1.4 | IC3.9 89.51,15.57 88.37,15.57 IC3.10 88.14,15.57 87.22,15.57 IC3.11 87,15.57 85.85,15.57 IC3.12 85.62,15.57 84.71,15.57 IC3.13 | 83.34,17.4 74.88,17.4 OK7.3 | 83.34,17.4 84.48,16.26 84.48,15.57 IC3.13 | C10.2 96.6,17.63 96.6,16.94 98.2,15.34 J1.P$1 98.42,15.11 98.42,12.83 | 98.42,12.83 98.42,12.6 J1.P$2 | J1.P$2 98.2,12.37 92.25,6.43 89.74,6.43 IC3.8 89.51,6.43 88.37,6.43 IC3.7 88.14,6.43 87.22,6.43 IC3.6 87,6.43 85.85,6.43 IC3.5 85.62,6.2 85.62,5.51 84.94,4.83 80.37,4.83 77.85,7.34 | 77.85,7.34 77.39,7.8 74.88,7.8 OK7.2 74.65,8.03 73.51,9.17 68.71,9.17 68.02,8.48 OK6.2 68.02,8.25 68.02,7.34 68.48,6.88 68.48,3.45 67.33,2.31 57.51,2.31 56.36,3.45 56.36,10.31
  Top 0.254: 77.85,7.34 84.48,13.97 84.48,15.34 IC3.13 | 83.34,17.4 v84.48,18.54 | 98.42,12.83 J1.P$2 | 32.36,32.26 36.47,32.26 U4.1 | 32.36,32.26 27.79,36.83 C2.- | 27.79,26.09 27.79,27.69 32.36,32.26 | 27.79,26.09 27.79,25.4 C1.- | T1.8 21.39,48.03 21.39,46.2 20.24,45.06 20.24,38.43 19.33,37.52 C5.2 19.1,37.29 19.1,32.49 14.99,28.37 13.39,28.37 | 9.96,22.43 10.41,22.43 R3.1 | 9.96,22.43 6.3,22.43 C4.2 6.07,22.43 6.07,27.69 5.61,28.14 5.42,28.21 | U$2.1 10.87,29.29 11.56,29.97 12.47,29.97 13.16,29.29 U$2.3 13.39,29.06 13.39,28.37 | 13.39,28.37 13.39,26.77 16.81,23.34 R4.1 17.04,23.34 19.79,26.09 27.79,26.09 | 9.96,22.43 9.96,8.94 SV2.1 10.18,8.71 10.18,4.37 SV3.1 10.41,4.14 12.24,2.31 29.62,2.31 30.53,3.23 30.53,8.94 | 30.53,8.94 33.5,8.94 34.42,9.86 37.16,9.86 38.08,8.94 OK5.2 38.3,8.94 39.45,10.08 44.25,10.08 45.39,8.94 OK2.2 45.62,8.94 46.53,9.86 51.79,9.86 | 30.53,8.94 30.3,8.94 OK1.2 30.53,8.94 | 51.79,9.86 52.7,8.94 53.16,8.94 OK3.2 53.39,8.94 54.76,10.31 56.36,10.31 | 56.36,10.31 59.33,10.31 60.48,9.17 60.48,8.71 OK4.2 | C6.2 46.08,43.69 46.08,46.89 46.76,47.57 BAT1.2 46.99,47.57 62.76,47.57 63.68,46.66 | 60.02,31.8 60.02,35 C7.1 | 60.02,31.8 60.02,30.43 C8.1 | 65.05,32.49 64.59,32.49 U3.5 65.05,32.49 | 65.05,32.49 65.51,32.94 65.51,33.63 65.05,34.09 | 65.05,34.09 64.59,34.09 U3.3 65.05,34.09 | 65.05,34.09 65.51,34.54 65.51,36.14 63.68,37.97 63.68,46.66 | 63.68,46.66 65.73,48.72 S1.1 65.96,48.95 70.76,48.95 S1.2 70.99,48.95 72.36,50.32 88.37,50.32 89.51,49.17 89.97,49.17 U$3.12 | 60.02,31.8 55.45,31.8 55.22,31.57 55.22,26.09 55.45,25.86 | 55.45,25.86 61.62,25.86 65.51,29.74 65.51,32.03 65.05,32.49
  Top 0.254: 51.79,9.86 51.79,14.66 54.99,17.86 54.99,25.4 55.45,25.86
  Top 0.406: 7.62,30.45 U2.GND1 | 7.62,30.45 9.51,30.45 U$2.1 | 7.62,30.45 6.38,29.21 6.38,29.17 5.42,28.21 4.06,28.21 3.1,29.17 3.1,31.19 U2.GND
  Bottom 0.254: v84.48,18.54 84.48,27.69 SV1.4
  pour Bottom: -2.54,74.93 149.86,74.93 149.86,-1.27 -2.54,-1.27
  pour Top: 0,74.93 149.86,74.93 149.86,-1.27 -2.54,-1.27 -2.54,74.93
GRX  (via drill 0.61)
  Top 0.254: v86.54,36.83 85.62,37.74 75.79,37.74 73.97,35.92 73.05,35.92 U3.24 | v110.08,28.6 110.54,28.6 111,29.06 111.68,29.06 U$8.21
  Bottom 0.254: v86.54,36.83 87.22,36.83 96.6,27.46 108.94,27.46 v110.08,28.6
GTX  (via drill 0.61)
  Top 0.254: v86.08,39.12 75.79,39.12 73.97,37.29 71.68,37.29 U3.25 | v108.03,29.29 109.63,27.69 111.45,27.69 111.68,27.91 U$8.20
  Bottom 0.254: v86.08,39.12 86.08,38.66 95.45,29.29 v108.03,29.29
HV  (via drill 0.61)
  Top 0.254: OK1.4 27.79,18.09 28.24,18.09 29.16,17.17 34.65,17.17 35.56,18.09 OK5.4 35.79,18.31 36.93,19.46 39.22,19.46 40.36,18.31 42.88,18.31 OK2.4 43.1,18.09 43.56,18.09 44.47,17.17 49.5,17.17 50.42,18.09 OK3.4 50.65,18.31 50.65,20.6 v52.48,22.43 | OK6.4 65.51,17.86 65.51,11 63.91,9.4 63.91,5.97 60.71,2.77 57.73,2.77 56.82,3.68 56.82,9.63 57.05,9.86 59.11,9.86 59.33,9.63 59.33,7.8 59.79,7.34 61.62,7.34 62.08,7.8 62.08,9.4 58.19,13.28 58.19,18.09 OK4.4 58.19,18.31 60.71,20.83 v60.71,22.43
  Bottom 0.254: R15.2 88.37,32.72 84.94,32.72 82.42,35.23 70.76,35.23 69.85,34.31 63.91,34.31 60.71,31.11 v60.71,22.43 v52.48,22.43
MCU_5V  (via drill 0.61)
  Top 0.254: SV3.6 22.76,4.37 22.76,6.2 20.24,8.71 SV2.5 | 45.39,37.06 44.47,37.06 SW2.CH1A | 45.39,37.06 46.08,37.06 52.93,43.92 R14.2 | v36.25,20.14 37.39,20.14 44.7,27.46 | 44.7,27.46 45.39,28.14 45.39,37.06 | R13.2 83.57,21.51 80.37,21.51 R12.2 80.14,21.74 v80.14,23.34 | 63.45,32.03 63.68,31.8 64.36,31.8 U3.6 | 63.45,32.03 63.45,32.94 63.68,33.17 64.36,33.17 U3.4 | v74.42,30.89 73.05,30.89 U3.18 | v62.99,32.03 63.45,32.03 | SV1.1 76.94,27.69 78.77,25.86 84.94,25.86 85.62,26.54 85.62,31.34 90.2,35.92 90.2,40.49 U$3.5 90.2,40.72 90.88,40.72 97.28,47.12 108.71,47.12 109.86,48.26 111.45,48.26 111.68,48.03 111.68,46.2 111.23,45.74 | 111.23,45.74 112.83,44.14 126.09,44.14 134.31,35.92 134.31,33.86 126.77,26.31 126.77,7.34 127.91,6.2 127.91,4.14 127.23,3.45 U1.5 | 111.23,45.74 109.86,45.74 108.03,43.92 108.03,36.83 IC2.3 | v45.16,27 44.7,27.46
  Bottom 0.254: v36.25,20.14 36.25,16.94 23.67,4.37 22.99,4.37 SV3.6 | v80.14,23.34 80.14,24.03 76.94,27.23 76.94,27.69 SV1.1 76.71,27.91 74.42,30.2 v74.42,30.89 73.28,32.03 v62.99,32.03 62.99,23.34 61.16,21.51 51.11,21.51 45.62,27 v45.16,27
N$1
  Top 0.254: R1.2 8.58,43.23 10.64,41.17 LED2.C
N$2
  Top 0.254: U$2.6 13.39,34.54 13.39,36.6 16.81,40.03 16.81,43.46 15.9,44.37 7.67,44.37 7.44,44.14 7.44,42.77 8.36,41.86 R1.1
N$3
  Top 0.254: R2.2 15.21,41.63 14.76,41.63 13.16,43.23 LED1.C
N$4
  Top 0.254: U$2.7 12.24,34.54 12.24,36.14 16.36,40.26 16.36,42.32 15.44,43.23 R2.1
N$5
  Top 0.254: U$2.2 12.24,29.06 12.24,22.66 R3.2
N$6
  Top 0.254: U$5.P2 38.99,39.57 39.67,38.89 39.67,32.26 U4.3 39.67,32.03 39.67,31.11 36.25,27.69 36.25,26.09 U$6.1
N$7
  Top 0.254: U4.4 38.3,34.77 38.3,32.49 U4.2 38.08,32.26 38.08,30.2 34.65,26.77 34.65,24.94 35.1,24.49 39.22,24.49 40.59,25.86 U$6.2 40.82,26.09 40.82,30.89 44.25,34.31 SW2.COM1 44.25,34.54 43.33,35.46 43.33,37.29 45.85,39.8 45.85,41.63 C6.1
N$8
  Top 0.254: T1.1 21.39,42.32 21.39,45.52 22.07,46.2 22.07,48.03 T1.7 22.07,48.26 22.53,48.26 T1.6
N$9  (via drill 0.61)
  Top 0.254: v20.7,37.52 20.7,32.26 21.39,31.57 21.39,30.43 U$1.1 | v23.22,40.03 23.22,42.09 T1.4
  Bottom 0.254: v23.22,40.03 v20.7,37.52
N$10
  Top 0.254: U$1.3 23.44,30.43 23.44,31.57 24.13,32.26 24.13,47.12 23.22,48.03 T1.5
N$11
  Top 0.254: U$1.2 22.3,30.2 17.04,24.94 R4.2
N$12  (via drill 0.61)
  Top 0.254: U$1.6 21.61,32.72 v21.61,33.63 21.61,41.4 21.84,41.63 21.84,42.09 T1.2 22.07,42.32 22.53,42.32 T1.3 | v25.5,22.43 22.99,24.94 C3.2
  Bottom 0.254: U$7.B- 25.5,14.43 v25.5,22.43 25.5,29.74 v21.61,33.63
N$13  (via drill 0.61)
  Top 0.254: v22.53,31.34 22.53,32.49 U$1.5 | C3.1 22.76,23.34 22.53,23.11 v22.53,21.97 22.53,18.31 R5.2
  Bottom 0.254: v22.53,21.97 v22.53,31.34
N$14  (via drill 0.61)
  Top 0.254: U$2.5 14.76,34.54 19.1,38.89 C5.1 19.33,39.12 19.33,47.35 20.93,48.95 23.67,48.95 33.73,38.89 | 33.73,38.89 38.3,43.46 38.76,43.46 U$5.P1 | 33.73,38.89 32.59,37.74 32.59,37.06 C2.+ 32.59,36.83 32.59,33.63 v33.05,33.17 | R5.1 22.76,16.71 30.3,24.26 30.3,24.49 30.99,25.17 32.36,25.17 C1.+ 32.59,25.17 v33.73,24.03
  Bottom 0.254: U$7.B+ 110.08,14.2 84.02,14.2 82.42,12.6 69.16,12.6 68.48,13.28 44.47,13.28 v33.73,24.03 33.05,24.71 v33.05,33.17
N$15
  Top 0.254: Q1.2 56.59,38.43 58.19,36.83 60.02,36.83 C7.2 60.25,36.6 60.94,35.92 60.94,32.72 62.76,30.89 64.36,30.89 U3.7
N$16
  Top 0.254: Q1.1 56.59,28.83 59.79,28.83 C8.2 60.02,28.83 61.16,29.97 64.36,29.97 U3.8
N$17  (via drill 0.61)
  Top 0.254: v66.42,15.8 66.42,12.6 67.56,11.45 81.28,11.45 83.11,13.28 83.11,15.34 IC3.14
  Bottom 0.254: v66.42,15.8 54.99,15.8 44.25,26.54 44.25,27.46 44.7,27.91 46.53,27.91 46.76,27.69 BAT1.1
N$18
  Top 0.254: C11.2 78.31,36.83 78.31,33.63 76.25,31.57 75.11,31.57 74.19,32.49 73.05,32.49 U3.20
N$19
  Bottom 0.254: R15.1 75.79,32.72 82.42,32.72 82.88,33.17 83.8,33.17 87,29.97 87,27.91 SV1.5
N$20
  Top 0.254: R18.2 96.37,32.03 97.05,32.03 98.88,30.2 99.57,30.2 U$8.3
N$21
  Top 0.254: R18.1 94.77,32.03 94.77,29.52 LED4.A
N$22
  Top 0.254: R6.1 27.79,3.91 27.79,8.71 OK1.1
N$23
  Top 0.254: R7.1 43.1,3.68 43.1,8.71 OK2.1
N$24
  Top 0.254: R8.1 50.88,3.68 50.88,8.48 50.65,8.71 OK3.1
N$25
  Top 0.254: R9.1 58.19,3.91 58.19,8.48 OK4.1
N$26
  Top 0.254: R10.1 35.79,3.68 35.79,8.71 OK5.1
N$27
  Top 0.254: R11.1 65.51,4.14 65.51,8.25 OK6.1
N$28  (via drill 0.61)
  Top 0.254: v29.62,5.05 29.62,3.91 R6.2 | v54.76,12.37 54.76,16.26 56.36,17.86 56.36,22.43 v58.88,24.94 | v64.82,38.2 65.73,37.29 U3.32
  Bottom 0.254: v29.62,5.05 47.45,5.05 v54.76,12.37 | v58.88,24.94 58.88,29.97 64.82,35.92 v64.82,38.2
N$29  (via drill 0.61)
  Top 0.254: v48.82,7.8 44.7,3.68 R7.2 | v53.39,12.37 53.39,15.57 55.91,18.09 v55.91,24.94 | v62.99,35.92 64.36,35.92 U3.1
  Bottom 0.254: v53.39,12.37 v48.82,7.8 | v55.91,24.94 55.91,29.74 62.08,35.92 v62.99,35.92
N$30  (via drill 0.61)
  Top 0.254: v52.7,7.11 52.7,3.68 R8.2 | v56.82,11.23 56.82,21.51 v58.65,23.34 | v62.31,34.77 64.36,34.77 U3.2
  Bottom 0.254: v56.82,11.23 v52.7,7.11 | v58.65,23.34 58.65,23.8 57.96,24.49 57.96,30.43 v62.31,34.77
N$31
  Top 0.254: R9.2 60.25,3.91 60.25,5.28 62.99,8.03 62.99,25.86 65.73,28.6 U3.9
N$32  (via drill 0.61)
  Top 0.254: v55.68,2.77 42.19,2.77 41.5,3.45 37.62,3.45 R10.2 | v63.91,10.77 63.91,11.23 63.45,11.68 63.45,24.71 66.65,27.91 66.65,28.6 U3.10
  Bottom 0.254: v55.68,2.77 63.68,10.77 v63.91,10.77
N$33  (via drill 0.61)
  Top 0.254: v67.33,6.66 67.33,4.14 R11.2 | v64.59,11.91 64.59,16.26 63.91,16.94 63.91,24.26 67.33,27.69 67.33,28.6 U3.11
  Bottom 0.254: v67.33,6.66 67.33,9.17 v64.59,11.91
N$34
  Top 0.254: U3.12 68.48,28.83 68.48,32.72 72.59,36.83 74.19,36.83 75.56,38.2 86.54,38.2 87.45,39.12 87.45,40.49 U$3.4
N$35
  Top 0.254: U3.13 69.16,28.6 69.16,26.09 70.76,24.49 88.82,24.49 91.34,27 91.34,36.6 95.23,40.49 U$3.7
N$36  (via drill 0.61)
  Top 0.254: v69.85,30.2 69.85,28.83 U3.14 | v79.68,20.14 v77.85,20.14 | v89.28,38.2 v83.34,32.26
  Bottom 0.254: v69.85,30.2 69.85,28.14 v77.85,20.14 | v79.68,20.14 79.68,20.83 83.34,24.49 v83.34,32.26 | v89.28,38.2 90.42,38.2 92.71,40.49 U$3.6
N$37  (via drill 0.61)
  Top 0.254: v102.08,16.48 102.08,13.74 92.48,4.14 74.42,4.14 R17.1 | v74.42,34.31 73.97,34.77 73.05,34.77 U3.23
  Bottom 0.254: v102.08,16.48 102.08,17.86 101.62,18.31 85.62,18.31 82.88,15.57 79.22,15.57 78.77,16.03 78.77,20.6 81.05,22.88 81.05,23.8 78.08,26.77 78.08,29.06 75.56,31.57 75.34,31.57 74.42,32.49 v74.42,34.31
N$39
  Top 0.254: 113.06,32.94 110.77,35.23 110.77,44.83 SW1.CH1B | 113.06,32.94 113.06,31.8 112.6,31.34 111.91,31.34 U$8.23 111.91,31.11 111.91,30.2 U$8.22 | 113.06,32.94 114.88,34.77 122.89,34.77 U$9.9
N$40
  Top 0.254: R17.2 72.59,4.14 72.59,7.57 72.36,7.8 OK7.1
N$41
  Top 0.254: C9.1 13.84,15.57 13.84,12.6 17.5,8.94 SV2.4
N$42
  Top 0.254: R16.2 128.37,30.89 131.8,34.31 131.8,34.77 U$9.15
N$43
  Top 0.254: R16.1 126.31,30.89 120.6,30.89 120.37,31.11 LED3.A
N$44
  Top 0.254: C10.1 95.23,17.86 95,18.09 95,20.14 L1.1 95,20.37 96.6,21.97 96.6,22.66 R19.2
N$45
  Top 0.254: R19.1 95,22.88 95.91,23.8 98.65,23.8 99.57,22.88 U$8.8 99.8,22.66 99.8,21.74 U$8.9
N$46  (via drill 3.3)
  other vias: 5.56,69.65
N$47
  Top 0.254: 98.42,19.91 98.65,19.68 99.57,19.68 U$8.11 | 98.42,19.91 98.2,20.14 96.6,20.14 L1.2 | 98.42,19.91 98.42,17.86 100.03,16.26 100.03,13.97 J1.P$3
N$48  (via drill 3.3)
  other vias: 140.79,69.55
N$49  (via drill 3.3)
  other vias: 141.04,4.81
N$50  (via drill 3.3)
  other vias: 4.49,5.31
RESET  (via drill 0.61)
  Top 0.254: SV3.2 12.7,4.37 11.33,5.74 11.33,14.88 12.93,16.48 14.53,16.48 15.21,15.8 C9.2 15.44,15.57 23.22,15.57 26.42,18.77 26.42,19.68 30.76,24.03 v31.22,24.03 | v52.7,45.29 51.56,44.14 R14.1 | U3.29 68.25,37.29 68.25,40.26 v64.59,43.92 65.73,45.06 S1.3 65.96,45.06 70.76,45.06 S1.4
  Bottom 0.254: v64.59,43.92 63.22,45.29 v52.7,45.29 43.79,45.29 31.22,32.72 v31.22,24.03
RX  (via drill 0.61)
  Top 0.254: v67.33,39.8 67.33,37.29 U3.30 | v24.59,49.4 20.7,49.4 17.27,45.97 17.27,38.43 v14.53,35.69
  Bottom 0.254: v67.33,39.8 67.33,42.55 64.14,45.74 53.62,45.74 49.96,49.4 v24.59,49.4 | v14.53,35.69 14.53,10.77 12.7,8.94 SV2.2
SCL  (via drill 0.61)
  Top 0.254: v127,5.74 127,4.6 U1.6 | v86.54,22.88 85.39,21.74 R13.1 85.17,21.51 84.02,20.37 v83.57,20.37 | v69.85,35.69 69.16,36.37 69.16,37.06 U3.28 | v79.68,16.48 80.59,15.57 IC3.16
  Bottom 0.254: v127,5.74 127,8.03 124.71,10.31 124.71,21.97 122.43,24.26 87.91,24.26 | v86.54,22.88 87.91,24.26 | v69.85,35.69 85.62,35.69 87.45,33.86 88.82,33.86 89.51,33.17 89.51,27.91 87.45,25.86 87.45,24.71 87.91,24.26 | v83.57,20.37 v79.68,16.48
SDA  (via drill 0.61)
  Top 0.254: 120.6,24.26 119.46,24.26 112.6,17.4 v101.17,17.4 | 120.6,24.26 122.43,24.26 124.71,21.97 124.71,8.25 124.48,8.03 124.48,4.6 U1.1 | 81.97,13.97 81.97,15.34 IC3.15 | 81.97,13.97 76.02,13.97 73.51,16.48 73.51,18.31 76.71,21.51 78.54,21.51 R12.1 | 81.97,13.97 v81.97,13.51 | v73.51,38.2 70.31,38.2 70.08,37.97 70.08,37.29 U3.27 | 120.6,24.26 v120.6,25.17
  Bottom 0.254: v101.17,17.4 85.85,17.4 v81.97,13.51 | v73.51,38.2 83.8,38.2 87.68,34.31 89.05,34.31 98.2,25.17 v120.6,25.17
T1  (via drill 0.61)
  Top 0.254: v30.07,21.97 30.07,18.31 OK1.3 | v15.67,54.43 v17.5,52.6
  Bottom 0.254: v30.07,21.97 30.07,40.03 v17.5,52.6 | v15.67,54.43 14.99,54.43 10.41,59 10.41,62.66 13.16,65.41 14.53,65.41 15.21,64.72 N1.A
T2  (via drill 0.61)
  Top 0.254: v54.08,46.66 54.08,32.94 45.62,24.49 45.62,18.31 OK2.3 | v49.28,57.86 47.9,57.86 39.22,66.55 37.39,66.55 N2.A
  Bottom 0.254: v54.08,46.66 54.08,53.06 v49.28,57.86
T3  (via drill 0.61)
  Top 0.254: v55.45,46.66 55.22,46.43 55.22,33.4 53.39,31.57 53.39,18.31 OK3.3 | v57.51,62.43 v52.93,57.86
  Bottom 0.254: v55.45,46.66 55.45,52.6 52.93,55.12 v52.93,57.86 | v57.51,62.43 60.48,65.41 62.76,65.41 63.45,64.72 N3.A
T4  (via drill 0.61)
  Top 0.254: v59.11,14.88 60.48,16.26 60.48,18.09 OK4.3 | v43.33,43.23 35.79,50.77 17.96,50.77 10.18,58.55 10.18,63.12 14.99,67.92 30.99,67.92 31.9,67.01 35.79,67.01 36.25,67.46 69.62,67.46 70.99,66.09 82.42,66.09 83.8,64.72 N4.A
  Bottom 0.254: v59.11,14.88 55.22,14.88 43.33,26.77 v43.33,43.23
T5  (via drill 0.61)
  Top 0.254: v20.7,14.66 34.19,14.66 37.62,18.09 38.08,18.09 OK5.3 | v108.71,64.49 109.63,65.41 111,65.41 111.68,64.72 N5.A
  Bottom 0.254: v20.7,14.66 20.7,32.49 9.04,44.14 9.04,63.35 15.44,69.75 102.54,69.75 107.8,64.49 v108.71,64.49
T6  (via drill 0.61)
  Top 0.254: v70.54,18.09 68.02,18.09 OK6.3 | v77.85,18.31 82.88,18.31 85.17,20.6 86.08,20.6 91.8,26.31 91.8,31.57 v103,42.77
  Bottom 0.254: v70.54,18.09 77.62,18.09 v77.85,18.31 | v103,42.77 120.14,42.77 133.17,55.8 134.31,55.8 137.29,58.78 137.29,62.43 134.31,65.41 132.94,65.41 132.26,64.72 N6.A
TX  (via drill 0.61)
  Top 0.254: v66.65,30.2 66.65,37.06 U3.31 | v62.08,16.71 62.08,13.06 v60.94,11.91
  Bottom 0.254: v66.65,30.2 66.65,21.29 v62.08,16.71 | v60.94,11.91 58.88,11.91 48.82,1.85 20.24,1.85 19.1,3 19.1,5.28 17.5,6.88 17.04,6.88 15.21,8.71 SV2.3
VBUS
  Top 0.254: 12.93,41.17 10.87,43.23 LED2.A | 10.14,33.68 14.53,29.29 U$2.4 | 6.53,33.05 6.53,35 3.56,37.97 1.5,37.97 1.27,37.74 1.27,25.63 4.47,22.43 C4.1 | 12.93,41.17 12.93,37.52 10.87,35.46 10.87,34.54 U$2.8 | 12.93,41.17 LED1.A
  Top 0.406: U2.VBUS1 6.53,33.05 9.51,33.05 10.14,33.68 U$2.8

### Text on the board
tPlace: TonyGUO | IN-16 Clock Ver.1 | 2017/08/31